# Altium schematic sheet four_axis_part1.SchDoc: NRF51822
size A4
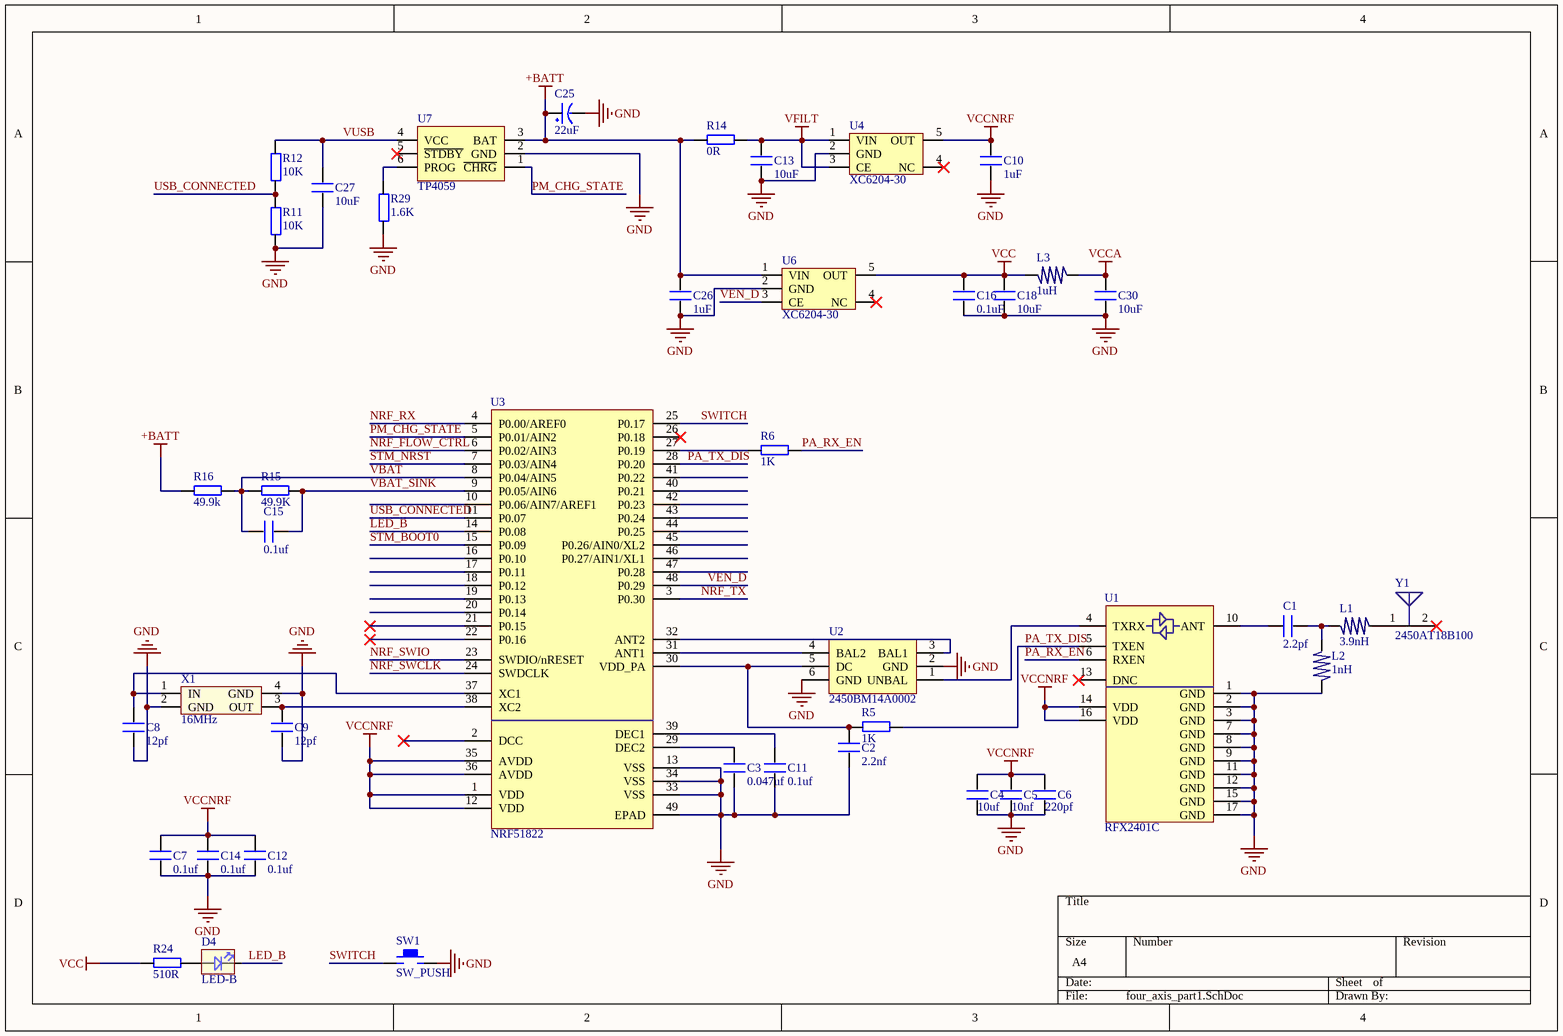
[diagram p0: four_axis_part1.SchDoc]

## Parts
C1  2.2pf  [0603P]
C2  2.2nf  [0603P]
C3  0.047uf  [0603P]
C4  10uf  [0603P]
C5  10nf  [0603P]
C6  220pf  [0603P]
C7  0.1uf  [0603P]
C8  12pf  [0603P]
C9  12pf  [0603P]
C10  1uF  [0603P]
C11  0.1uf  [0603P]
C12  0.1uf  [0603P]
C13  10uF  [0603P]
C14  0.1uf  [0603P]
C15  0.1uf  [0603P]
C16  0.1uF  [0603P]
C18  10uF  [0603P]
C25  22uF  [C0805 钽电容]
C26  1uF  [0603P]
C27  10uF  [0603P]
C30  10uF  [0603P]
D4  LED-B  [LED1206  侧贴]
L1  3.9nH  [0603P]
L2  1nH  [0603P]
L3  1uH  [0603P]
R5  1K  [0402]
R6  1K  [0402]
R11  10K  [0402]
R12  10K  [0402]
R14  0R  [0402]
R15  49.9K  [0402]
R16  49.9k  [0402]
R24  510R  [0402]
R29  1.6K  [0402]
SW1  SW_PUSH  [KEY_2S]
U1  RFX2401C  [QFN16M]
U2  2450BM14A0002  [0603-6]
U3  NRF51822  [QFN48M-04]
U4  XC6204-30  [SOT23-5S]
U6  XC6204-30  [SOT23-5S]
U7  TP4059  [SOT23-6S]
X1  16MHz  [XTAL3225   无源]
Y1  2450AT18B100  [1206]

## Nets
+BATT: C25.1(VCC) C26.2 R14.2 R16.2 U6.1(VIN) U7.3(BAT)
GND: C2.1 C3.2 C4.1 C5.1 C6.1 C7.2 C8.2 C9.2 C10.1 C11.2 C12.2 C13.1 C14.2 C16.1 C18.1 C25.2(GND) C26.1 C27.1 C30.1 L2.2 R11.1 R29.1 SW1.2 U1.1(GND) U1.2(GND) U1.3(GND) U1.7(GND) U1.8(GND) U1.9(GND) U1.11(GND) U1.12(GND) U1.15(GND) U1.17(GND) U2.2(GND) U2.6(GND) U3.13(VSS) U3.33(VSS) U3.34(VSS) U3.49(EPAD) U4.2(GND) U6.2(GND) U7.2(GND) X1.2(GND) X1.4(GND)
VCC: C16.2 C18.2 L3.2 R24.2 U6.5(OUT)
VCCA: C30.2 L3.1
VCCNRF: C4.2 C5.2 C6.2 C7.1 C10.2 C12.1 C14.1 U1.14(VDD) U1.16(VDD) U3.1(VDD) U3.12(VDD) U3.35(AVDD) U3.36(AVDD) U4.5(OUT)
VFILT: C13.2 R14.1 U4.1(VIN) U4.3(CE)
LED_B: D4.1 U3.14(P0.08)
NRF_FLOW_CTRL: U3.6(P0.02/AIN3)
NRF_RX: U3.4(P0.00/AREF0)
NRF_SWCLK: U3.24(SWDCLK)
NRF_SWIO: U3.23(SWDIO/nRESET)
NRF_TX: U3.3(P0.30)
PA_RX_EN: R6.1 U1.6(RXEN)
PA_TX_DIS: R5.1 U1.5(TXEN) U3.28(P0.20)
PM_CHG_STATE: U3.5(P0.01/AIN2) U7.1(~{CHRG})
STM_BOOT0: U3.15(P0.09)
STM_NRST: U3.7(P0.03/AIN4)
SWITCH: SW1.1 U3.25(P0.17)
USB_CONNECTED: R11.2 R12.1 U3.11(P0.07)
VBAT: C15.2 R15.2 R16.1 U3.8(P0.04/AIN5)
VBAT_SINK: C15.1 R15.1 U3.9(P0.05/AIN6)
VEN_D: U3.48(P0.29) U6.3(CE)
VUSB: C27.2 R12.2 U7.4(VCC)
NetC1_1: C1.1 L1.1 L2.1
NetC1_2: C1.2 U1.10(ANT)
NetC2_2: C2.2 R5.2 U2.5(DC) U3.30(VDD_PA)
NetC3_1: C3.1 U3.29(DEC2)
NetC8_1: C8.1 U3.37(XC1) X1.1(IN)
NetC9_1: C9.1 U3.38(XC2) X1.3(OUT)
NetC11_1: C11.1 U3.39(DEC1)
NetD4_3: D4.3 R24.1
NetL1_2: L1.2 Y1.1(FP)
NetR6_2: R6.2 U3.27(P0.19)
NetR29_2: R29.2 U7.6(PROG)
NetU1_4: U1.4(TXRX) U2.1(UNBAL)
NetU2_3: U2.3(BAL1) U3.32(ANT2)
NetU2_4: U2.4(BAL2) U3.31(ANT1)

Not connected (* = marked no-connect by the designer): D4 2; U1 13(DNC)*; U3 2(DCC)* 10(P0.06/AIN7/AREF1) 16(P0.10) 17(P0.11) 18(P0.12) 19(P0.13) 20(P0.14) 21(P0.15)* 22(P0.16)* 26(P0.18)* 40(P0.21) 41(P0.22) 42(P0.23) 43(P0.24) 44(P0.25) 45(P0.26/AIN0/XL2) 46(P0.27/AIN1/XL1) 47(P0.28); U4 4(NC)*; U6 4(NC)*; U7 5(~{STDBY})*; Y1 2(NC)*

## Library data of the parts
C1-C16 C18 C26 C27 C30 = C
C25 = CAP
D4 = LED 1206 侧贴  单色
L1-L3 = L
R5 R6 R11 R12 R14-R16 R24 R29 = R
SW1 = KEY
U2 = BALUN
U4 U6 = XC6204
X1 = XTAL-无源贴片: 无源贴片晶振
Y1 = CHIP_ANTENNA